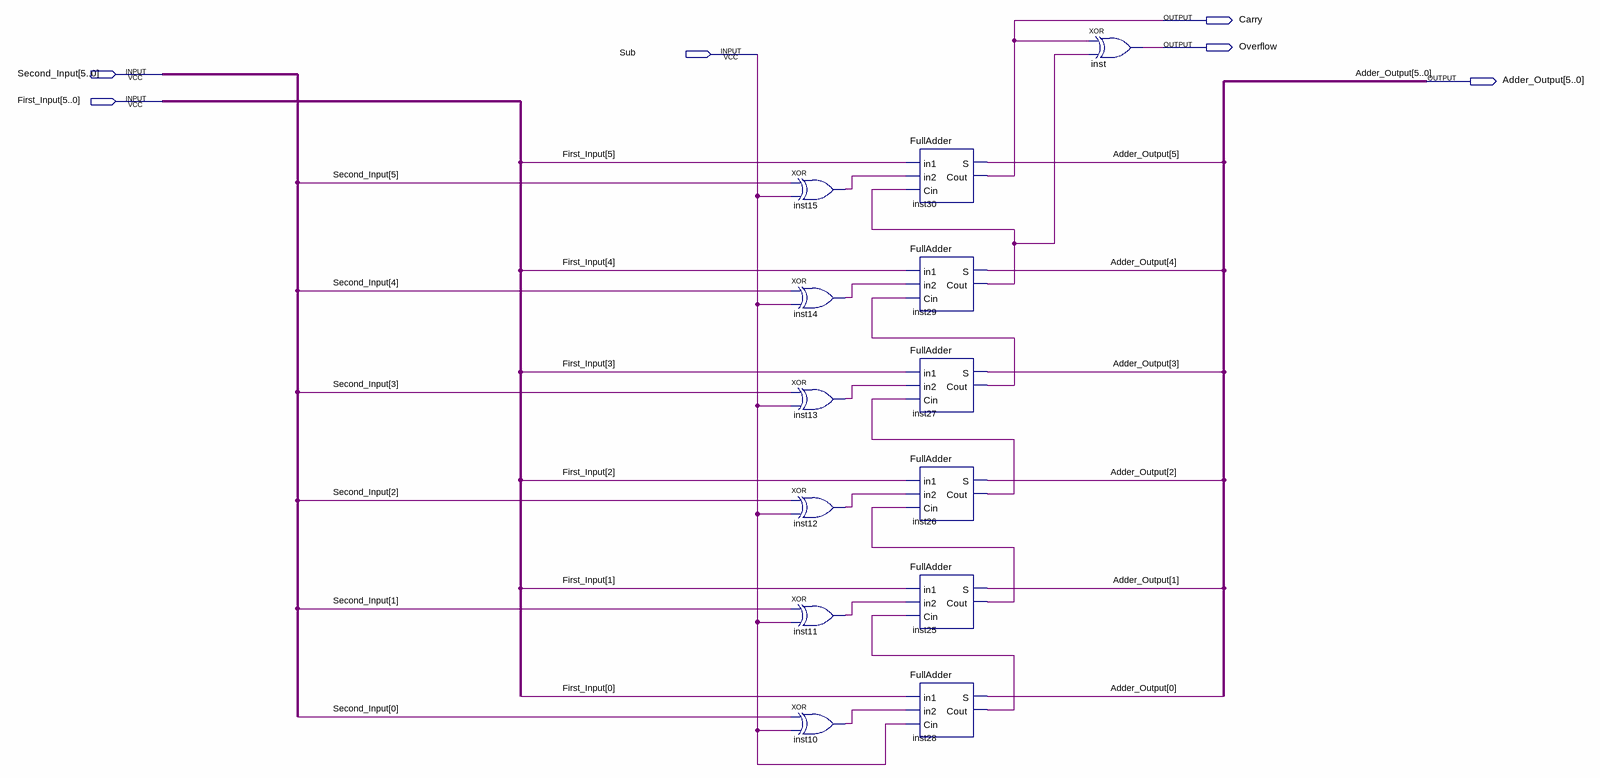
[diagram p0: schematic sheet]
// Quartus schematic 6bitAdder.bdf as structural Verilog: 13 symbols, 6 pins
module \6bitAdder  (
  input  Sub,
  input  [5:0] Second_Input,
  input  [5:0] First_Input,
  output Carry,
  output Overflow,
  output [5:0] Adder_Output
);

  wire inst10_out, inst11_out, inst12_out, inst13_out, inst14_out, inst15_out, inst25_cout, inst26_cout,
       inst27_cout, inst28_cout, inst29_cout;

  xor inst15 (inst15_out, Second_Input[5], Sub);
  xor inst14 (inst14_out, Second_Input[4], Sub);
  xor inst13 (inst13_out, Second_Input[3], Sub);
  xor inst12 (inst12_out, Second_Input[2], Sub);
  xor inst11 (inst11_out, Second_Input[1], Sub);
  xor inst10 (inst10_out, Second_Input[0], Sub);
  FullAdder inst30 (.in1(First_Input[5]), .in2(inst15_out), .Cin(inst29_cout), .S(Adder_Output[5]), .Cout(Carry));
  FullAdder inst29 (.in1(First_Input[4]), .in2(inst14_out), .Cin(inst27_cout), .S(Adder_Output[4]), .Cout(inst29_cout));
  FullAdder inst27 (.in1(First_Input[3]), .in2(inst13_out), .Cin(inst26_cout), .S(Adder_Output[3]), .Cout(inst27_cout));
  FullAdder inst26 (.in1(First_Input[2]), .in2(inst12_out), .Cin(inst25_cout), .S(Adder_Output[2]), .Cout(inst26_cout));
  FullAdder inst25 (.in1(First_Input[1]), .in2(inst11_out), .Cin(inst28_cout), .S(Adder_Output[1]), .Cout(inst25_cout));
  FullAdder inst28 (.in1(First_Input[0]), .in2(inst10_out), .Cin(Sub), .S(Adder_Output[0]), .Cout(inst28_cout));
  xor inst (Overflow, Carry, inst29_cout);
endmodule
